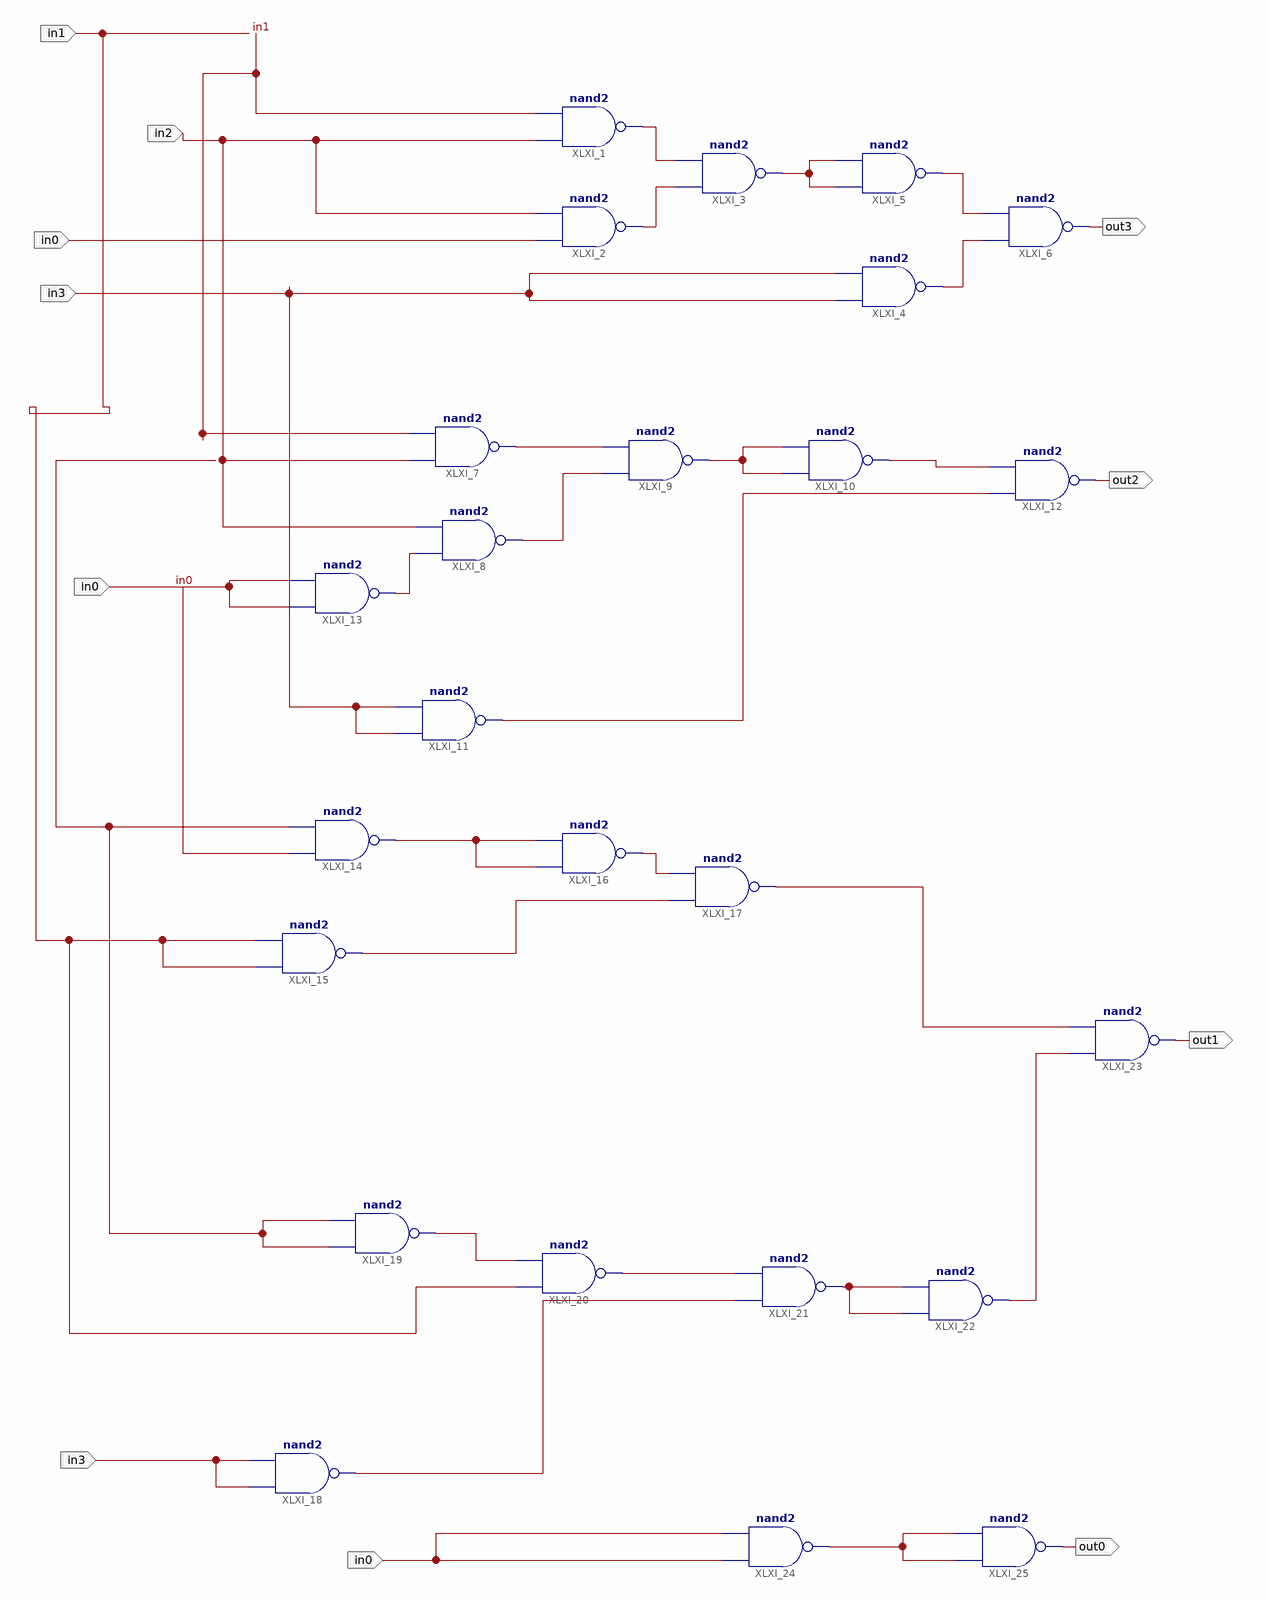
[diagram p0: schematic sheet 1]
// Xilinx ISE schematic Q2.sch (artix7) as structural Verilog: 25 symbols, 8 ports
module Q2 (
  input  in1,
  input  in2,
  input  in0,
  input  in3,
  output out3,
  output out2,
  output out1,
  output out0
);

  wire XLXN_6, XLXN_7, XLXN_8, XLXN_15, XLXN_16, XLXN_21, XLXN_22, XLXN_23, XLXN_26, XLXN_28, XLXN_30,
       XLXN_52, XLXN_53, XLXN_54, XLXN_64, XLXN_66, XLXN_72, XLXN_74, XLXN_75, XLXN_76, XLXN_80;

  nand XLXI_1 (XLXN_6, in2, in1);
  nand XLXI_2 (XLXN_7, in0, in2);
  nand XLXI_3 (XLXN_8, XLXN_7, XLXN_6);
  nand XLXI_4 (XLXN_16, in3, in3);
  nand XLXI_5 (XLXN_15, XLXN_8, XLXN_8);
  nand XLXI_6 (out3, XLXN_16, XLXN_15);
  nand XLXI_7 (XLXN_21, in2, in1);
  nand XLXI_8 (XLXN_22, XLXN_23, in2);
  nand XLXI_9 (XLXN_26, XLXN_22, XLXN_21);
  nand XLXI_10 (XLXN_28, XLXN_26, XLXN_26);
  nand XLXI_11 (XLXN_30, in3, in3);
  nand XLXI_12 (out2, XLXN_30, XLXN_28);
  nand XLXI_13 (XLXN_23, in0, in0);
  nand XLXI_14 (XLXN_52, in0, in2);
  nand XLXI_15 (XLXN_53, in1, in1);
  nand XLXI_16 (XLXN_54, XLXN_52, XLXN_52);
  nand XLXI_17 (XLXN_75, XLXN_53, XLXN_54);
  nand XLXI_18 (XLXN_72, in3, in3);
  nand XLXI_19 (XLXN_64, in2, in2);
  nand XLXI_20 (XLXN_66, in1, XLXN_64);
  nand XLXI_21 (XLXN_74, XLXN_72, XLXN_66);
  nand XLXI_22 (XLXN_76, XLXN_74, XLXN_74);
  nand XLXI_23 (out1, XLXN_76, XLXN_75);
  nand XLXI_24 (XLXN_80, in0, in0);
  nand XLXI_25 (out0, XLXN_80, XLXN_80);
endmodule
